# Altium project pca10171.PrjPCB (part 4 of 4)

## Sheet pca10171_power_supply.SchDoc: =BoardTitle + ' - Power Supply'
size A3; Organization: Nordic Semiconductor; DocumentNumber: 8; Revision: 1.0.1; SheetNumber: 8; SheetTotal: 10; Author: KOD1; CompanyName: Nordic Semiconductor; DrawnBy: KOD1; DocumentSize: A3; ProjectName: nRF91 DK
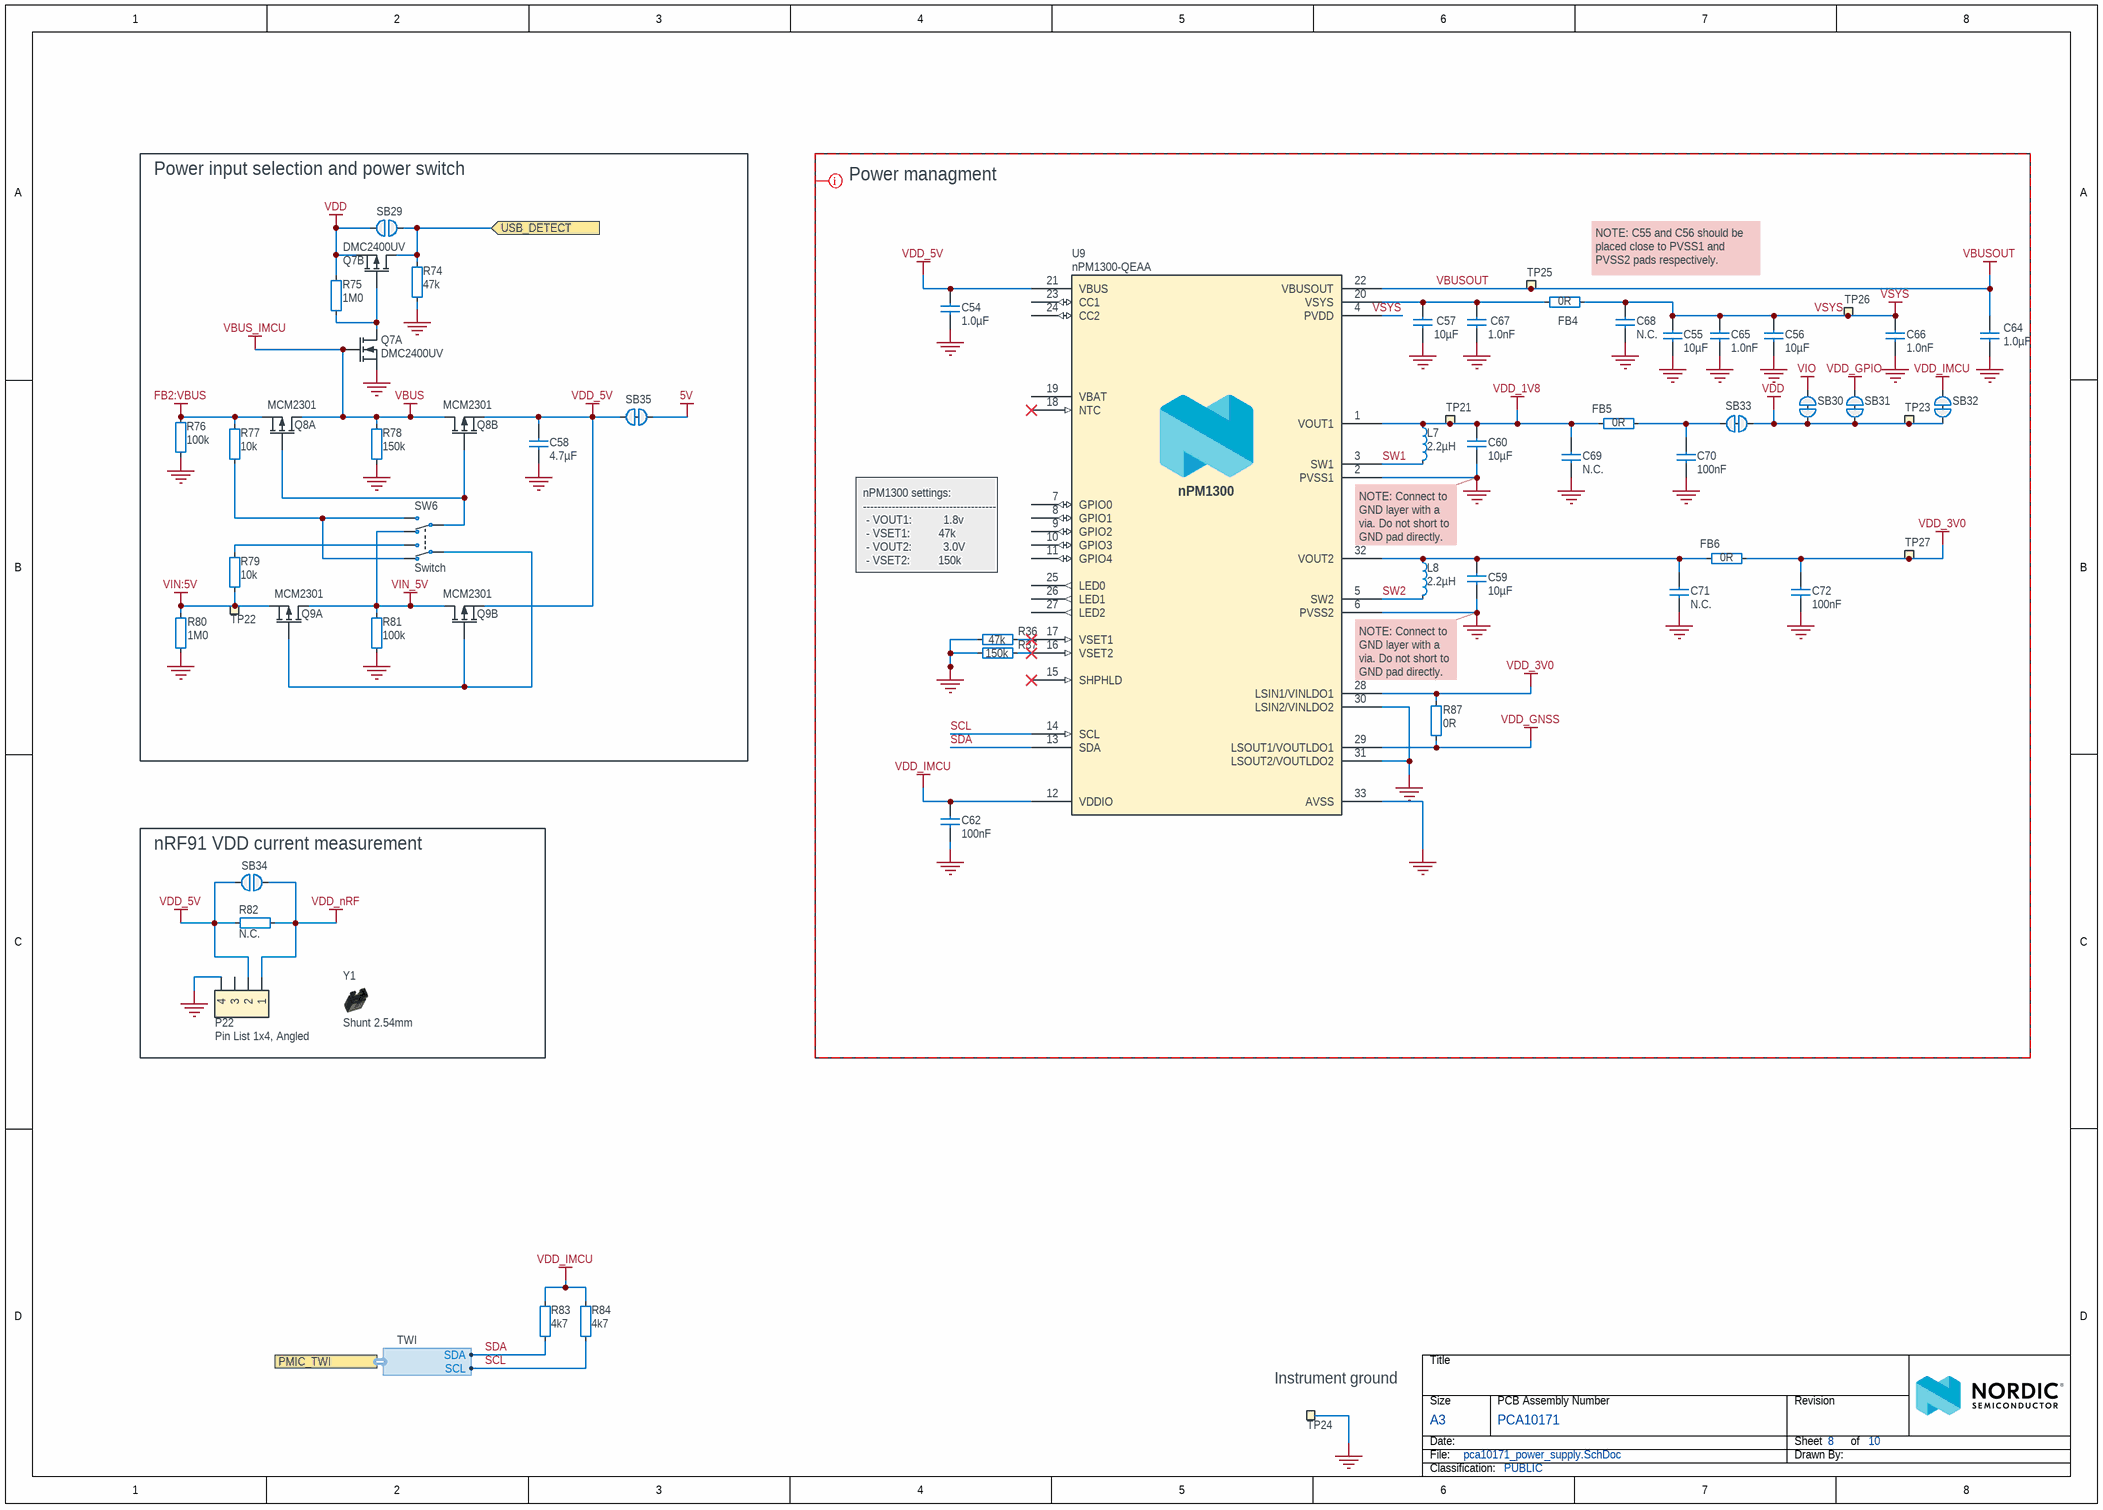
[diagram p9: pca10171_power_supply.SchDoc]

### Parts
C54  1.0µF  [CAPC1608X06L]
C55  10µF  [CAPC1608X06L]
C56  10µF  [CAPC1608X06L]
C57  10µF  [CAPC1608X06L]
C58  4.7µF  [CAPC1608X06L]
C59  10µF  [CAPC1608X06L]
C60  10µF  [CAPC1608X06L]
C62  100nF  [CAPC0603X03L_C]
C64  1.0µF  [CAPC1005X04L]
C65  1.0nF  [CAPC0603X03L_C]
C66  1.0nF  [CAPC0603X03L_C]
C67  1.0nF  [CAPC0603X03L_C]
C68  N.C.  [CAPC1608X06L_NC]
C69  N.C.  [CAPC1608X06L_NC]
C70  100nF  [CAPC1608X06L]
C71  N.C.  [CAPC1608X06L_NC]
C72  100nF  [CAPC1608X06L]
FB4  0R  [RESC2012X11L]
FB5  0R  [RESC2012X11L]
FB6  0R  [RESC2012X11L]
L7  2.2µH  [INDC2016X10N]
L8  2.2µH  [INDC2016X10N]
P22  Pin List 1x4, Angled  [LIST_ANG_1x4-SMD-2.54MM]
Q7  DMC2400UV  [SOTFL50P162X60-6N]  (parts A,B of 2)
Q8  MCM2301  [DFN65P200X200X80_HS-6N]  (parts A,B of 2)
Q9  MCM2301  [DFN65P200X200X80_HS-6N]  (parts A,B of 2)
R36  47k  [RESC0603X03L_C]
R37  150k  [RESC0603X03L_C]
R74  47k  [RESC0603X03L_C]
R75  1M0  [RESC0603X03L_C]
R76  100k  [RESC0603X03L_C]
R77  10k  [RESC0603X03L_C]
R78  150k  [RESC0603X03L_C]
R79  10k  [RESC0603X03L_C]
R80  1M0  [RESC0603X03L_C]
R81  100k  [RESC0603X03L_C]
R82  N.C.  [RESC1005X04L_NC]
R83  4k7  [RESC0603X03L_C]
R84  4k7  [RESC0603X03L_C]
R87  0R  [RESC0603X03L_C]
SB29  Solderbridge  [Solderbridge]  (value not drawn)  (no BOM)
SB30  Solderbridge  [Solderbridge_Shorted_Power]  (value not drawn)  (net tie, no BOM)
SB31  Solderbridge  [Solderbridge_Shorted_Power]  (value not drawn)  (net tie, no BOM)
SB32  Solderbridge  [Solderbridge_Shorted]  (value not drawn)  (net tie, no BOM)
SB33  Solderbridge  [Solderbridge_Shorted_Power]  (value not drawn)  (net tie, no BOM)
SB34  Solderbridge  [Solderbridge]  (value not drawn)  (no BOM)
SB35  Solderbridge  [Solderbridge_Shorted_Power]  (value not drawn)  (net tie, no BOM)
SW6  Switch  [JS102011JAQN]
TP21  Ø1.5mm,SMD  [TP_SMD_D1.5mm]  (value not drawn)  (no BOM)
TP22  Ø1.5mm,SMD  [TP_SMD_D1.5mm]  (value not drawn)  (no BOM)
TP23  Ø1.5mm,SMD  [TP_SMD_D1.5mm]  (value not drawn)  (no BOM)
TP24  TP  [TESTPAD-TH]  (value not drawn)  (no BOM)
TP25  Ø1.5mm,SMD  [TP_SMD_D1.5mm]  (value not drawn)  (no BOM)
TP26  Ø1.5mm,SMD  [TP_SMD_D1.5mm]  (value not drawn)  (no BOM)
TP27  Ø1.5mm,SMD  [TP_SMD_D1.5mm]  (value not drawn)  (no BOM)
U9  nPM1300-QEAA  [Nordic_QFN50P500X500X90-33N]
Y1  Shunt 2.54mm  [Shunt_2.54mm_Horizontal]

### Blocks framed on the sheet
Power input selection and power switch: C58 Q7-Q9 R74-R81 SB29 SB35 SW6 TP22
Power managment: C54-C57 C59 C60 C62 C64-C72 FB4-FB6 L7 L8 R36 R37 R87 SB30-SB33 TP21 TP23 TP25-TP27 U9
nRF91 VDD current measurement: P22 R82 SB34 Y1

### Ports
PMIC_TWI (harness TWI), USB_DETECT (in)

### Harnesses
TWI: SCL, SDA

### Nets
5V: SB35.2
FB2:VBUS: Q8.1(S1) R76.1 R77.1
GND: C54.1 C55.1 C56.1 C57.1 C58.1 C59.1 C60.1 C62.2 C64.1 C65.1 C66.1 C67.1 C68.1 C69.1 C70.1 C71.1 C72.1 P22.4 Q7.1(S1) R36.2 R37.2 R74.1 R76.2 R78.1 R80.2 R81.2 TP24.1 U9.2(PVSS1) U9.6(PVSS2) U9.30(LSIN2/VINLDO2) U9.31(LSOUT2/VOUTLDO2) U9.33(AVSS)
VBUS: Q7.2(G1) Q8.3(D2) Q8.6(D1) R78.2  [also labelled VBUS_IMCU]
VBUSOUT: C64.2 TP25.1 U9.22(VBUSOUT)
VDD: Q7.4(S2) R75.1 SB29.1 SB30.2 SB31.1 SB32.1 SB33.2 TP23.1
VDD_1V8: C60.2 C69.2 FB5.1 L7.1 TP21.1 U9.1(VOUT1)
VDD_3V0: C72.2 FB6.2 R87.1 TP27.1 U9.28(LSIN1/VINLDO1)
VDD_5V: C54.2 C58.2 P22.2 Q8.4(S2) Q9.4(S2) R82.2 SB34.2 SB35.1 U9.21(VBUS)
VDD_GNSS: R87.2 U9.29(LSOUT1/VOUTLDO1)
VDD_GPIO: SB31.2
VDD_IMCU: C62.1 R83.2 R84.2 SB32.2 U9.12(VDDIO)
VDD_nRF: P22.1 R82.1 SB34.1
VIN:5V: Q9.1(S1) R79.2 R80.1 TP22.1
VIN_5V: Q9.3(D2) Q9.6(D1) R81.1 SW6.6(N.C-2)
VIO: SB30.1
VSYS: C55.2 C56.2 C65.2 C66.2 C68.2 FB4.2 TP26.1 U9.4(PVDD)
SCL: R84.1 U9.14(SCL) ; port PMIC_TWI.SCL  [project net IMCU_SCL]
SDA: R83.1 U9.13(SDA) ; port PMIC_TWI.SDA  [project net IMCU_SDA]
SW1: L7.2 U9.3(SW1)
SW2: L8.2 U9.5(SW2)
USB_DETECT: Q7.3(D2) R74.2 SB29.2 ; port USB_DETECT
NetC57_2: C57.2 C67.2 FB4.1 U9.20(VSYS)
NetC59_2: C59.2 C71.2 FB6.1 L8.1 U9.32(VOUT2)
NetC70_2: C70.2 FB5.2 SB33.1
NetQ7_5: Q7.5(G2) Q7.6(D1) R75.2
NetQ8_2: Q8.2(G1) Q8.5(G2) SW6.5(COM-2)
NetQ9_2: Q9.2(G1) Q9.5(G2) SW6.2(COM-1)
NetR36_1: R36.1 U9.17(VSET1)
NetR37_1: R37.1 U9.16(VSET2)
NetR77_2: R77.2 SW6.3(N.C-1) SW6.4(N.O-2)
NetR79_1: R79.1 SW6.1(N.O-1)

Not connected (* = marked no-connect by the designer): P22 3; U9 7(GPIO0) 8(GPIO1) 9(GPIO2) 10(GPIO3) 11(GPIO4) 15(SHPHLD)* 18(NTC)* 19(VBAT) 23(CC1) 24(CC2) 25(LED0) 26(LED1) 27(LED2)

### Layout directives
CompClassName: nPM1300: GND, SCL, SDA, SW1, SW2, VBUSOUT, VDD, VDD_1V8, VDD_3V0, VDD_5V, VDD_GNSS, VDD_GPIO, VDD_IMCU, VIO, VSYS

### Notes on the sheet
- NOTE: C55 and C56 should be placed close to PVSS1 and PVSS2 pads respectively.
- nPM1300 settings:
  -------------------------------------
  - VOUT1:          1.8v
  - VSET1:	        47k
  - VOUT2:          3.0V
  - VSET2:	        150k
- NOTE: Connect to GND layer with a via. Do not short to GND pad directly.
- (near TP24) Instrument ground
- Title
- Size
- Date:
- File:
- A3
- PCB Assembly Number
- Sheet         of
- Drawn By:
- Revision
- Classification:
- (in symbol nPM1300-QEAA) nPM1300

### Library data of the parts
C54 = C0603-1µ0-10V-X5R: Capacitor, Ceramic, 1.0µF 10V X5R 0603,±10%; Manufacturer: N.A.; Part number NEMS: 100200528; Component Status: Active; Pad Count: 2; Part Number: C0603-1µ0-10V-X5R; PartId: 100200528; Component Class: Capacitors; Author: getr; Manufacturer Part Number: N.A.; ComponentLink1URL: N.A.; ComponentLink1Description: Datasheet; ComponentLink2URL: N.A.; ComponentLink2Description: Supplier link; HelpURL: N.A.; LatestRevisionDate: 2022-10-06; Published: 2022-10-06; Footprint Doc: 0603; Value: 1.0µF; Note: 10V; Supplier 1: N.A.; Supplier Part Number 1: N.A.; Supplier 2: N.A.; Supplier Part Number 2: N.A.; Artikkelnr Noca: N.A.; Part number IPS: N.A.; Part number Norautron: N.A.
C55-C57 C59 C60 = C0603-10µ-10V-X7T-GRM188D71A106MA73: Capacitor, X7T, ±20%, 10V; Manufacturer: Murata; Part number IPS: 00000004696; Part number NEMS: 100200414; Component Status: Active; Pad Count: 2; Note: 10VDC; Artikkelnr Noca: N.A.; Part Number: C0603-10µ-10V-X7T-GRM188D71A106MA73; PartId: 100200414; Component Class: Capacitors; Author: rsk; Manufacturer Part Number: GRM188D71A106MA73; ComponentLink1URL: N.A.; ComponentLink1Description: Datasheet; ComponentLink2URL: N.A.; ComponentLink2Description: Supplier link; HelpURL: https://no.mouser.com/datasheet/2/281/murata_03052018_GRM_Series_1-1310166.pdf; LatestRevisionDate: 2021-07-22; Published: 2018-09-11; Footprint Doc: 0603; Value: 10µF; Supplier 1: Digi-Key; Supplier Part Number 1: 490-7200-1-ND; Supplier 2: Mouser; Supplier Part Number 2: 81-GRM188D71A106MA3D; Part number Norautron: N.A.
C58 = C0603-4µ7-10V-X5R: Capacitor, Ceramic, X5R, ±10%, 10V; Manufacturer: N.A.; Part number Norautron: 262081761; Part number NEMS: 100200479; Pad Count: 2; Component Status: Active; Part Number: C0603-4µ7-10V-X5R; Manufacturer Part Number: N.A.; ComponentLink1URL: N.A.; ComponentLink1Description: Datasheet; ComponentLink2URL: N.A.; ComponentLink2Description: Supplier link; HelpURL: N.A.; Footprint Doc: 0603; LatestRevisionDate: 2021-07-22; Published: 2021-07-22; Value: 4.7µF; Note: 10V; Supplier 1: N.A.; Supplier Part Number 1: N.A.; Supplier 2: N.A.; Supplier Part Number 2: N.A.; Artikkelnr Noca: N.A.; Part number IPS: N.A.; Component Class: Capacitors; PartId: 100200479; Author: rubr
C62 = C0201-100n: Capacitor, X5R, ±10%; Manufacturer: N.A.; Part number IPS: 00000001248, 00000002505; Part number Norautron: 262071862; Part number NEMS: 100200078; Pad Count: 2; Note: 16V; Component Status: Active; Part Number: C0201-100n; Value: 100nF; Footprint Doc: 0201; Component Class: Capacitors; Author: rsk; PartId: 100200078; Manufacturer Part Number: N.A.; ComponentLink1URL: N.A.; ComponentLink1Description: Datasheet; ComponentLink2URL: N.A.; ComponentLink2Description: Supplier link; HelpURL: N.A.; LatestRevisionDate: 2017-11-09; Published: 2014-11-13; Supplier 1: N.A.; Supplier Part Number 1: N.A.; Supplier 2: N.A.; Supplier Part Number 2: N.A.; Artikkelnr Noca: N.A.
C64 = C0402-1µ0-10V-X5R: Capacitor, Ceramic, X5R, ±10%, 10V; Manufacturer: N.A.; Part number NEMS: 100200482; Pad Count: 2; Component Status: Active; Part Number: C0402-1µ0-10V-X5R; Manufacturer Part Number: N.A.; Footprint Doc: 0402; LatestRevisionDate: 2021-07-22; Published: 2021-07-22; Value: 1.0µF; Note: 10V; Artikkelnr Noca: N.A.; Part number IPS: N.A.; ComponentLink1URL: N.A.; ComponentLink1Description: Datasheet; ComponentLink2URL: N.A.; ComponentLink2Description: Supplier link; HelpURL: N.A.; Supplier 1: N.A.; Supplier Part Number 1: N.A.; Supplier 2: N.A.; Supplier Part Number 2: N.A.; Component Class: Capacitors; PartId: 100200482; Author: rubr; Part number Norautron: N.A.
C65-C67 = C0201-1n0: Capacitor, X7R, ±10%, 25V; Manufacturer: N.A.; Part number IPS: 00000003206; Part number NEMS: 100200056; Component Status: Active; Pad Count: 2; Note: 16V; Part Number: C0201-1n0; PartId: 100200056; Component Class: Capacitors; Author: rsk; Manufacturer Part Number: N.A.; ComponentLink1URL: N.A.; ComponentLink1Description: Datasheet; ComponentLink2URL: N.A.; ComponentLink2Description: Supplier link; HelpURL: N.A.; LatestRevisionDate: 2020-10-13; Published: 2014-11-13; Footprint Doc: 0201; Value: 1.0nF; Supplier 1: N.A.; Supplier Part Number 1: N.A.; Supplier 2: N.A.; Supplier Part Number 2: N.A.; Artikkelnr Noca: N.A.; Part number Norautron: N.A.
C68 C69 C71 = C0603-N.C.: Not mounted; Manufacturer: N.A.; Part number NEMS: 100200195; Component Status: Active; Pad Count: 2; Note: Chip Cap; Assembly: Not mounted; Part Number: C0603-N.C.; PartId: 100200195; Component Class: Capacitors; Author: rsk; Manufacturer Part Number: N.A.; ComponentLink1URL: N.A.; ComponentLink1Description: Datasheet; ComponentLink2URL: N.A.; ComponentLink2Description: Supplier link; HelpURL: N.A.; Footprint Doc: 0603; LatestRevisionDate: 2009-05-08; Published: 2009-05-08; Value: N.C.; Supplier 1: N.A.; Supplier Part Number 1: N.A.; Supplier 2: N.A.; Supplier Part Number 2: N.A.; Artikkelnr Noca: N.A.; Part number IPS: N.A.; Part number Norautron: N.A.
C70 C72 = C0603-100n: Chip Cap 0603; Manufacturer: N.A.; Part number NEMS: 100200265; Component Status: Active; Pad Count: 2; Note: Chip Cap 1%; Part Number: C0603-100n; PartId: 100200265; Component Class: Capacitors; Author: rsk; Manufacturer Part Number: N.A.; ComponentLink1URL: N.A.; ComponentLink1Description: Datasheet; ComponentLink2URL: N.A.; ComponentLink2Description: Supplier link; HelpURL: N.A.; Footprint Doc: 0603; LatestRevisionDate: 2009-05-08; Published: 2009-05-08; Value: 100nF; Supplier 1: N.A.; Supplier Part Number 1: N.A.; Supplier 2: N.A.; Supplier Part Number 2: N.A.; Artikkelnr Noca: N.A.; Part number IPS: N.A.; Part number Norautron: N.A.
FB4-FB6 = R0805-0R: Resistor, ±5%, 0.125W; Manufacturer: N.A.; Part number NEMS: 100100375; Component Status: Active; Pad Count: 2; Note: Chip Res 5%; Artikkelnr Noca: 27089000; Part Number: R0805-0R; PartId: 100100375; Component Class: Resistors; Author: rsk; Manufacturer Part Number: N.A.; ComponentLink1URL: N.A.; ComponentLink1Description: Datasheet; ComponentLink2URL: N.A.; ComponentLink2Description: Supplier link; HelpURL: N.A.; Footprint Doc: 0805; LatestRevisionDate: 2013-06-04; Published: 2009-05-08; Value: 0R; Supplier 1: N.A.; Supplier Part Number 1: N.A.; Supplier 2: N.A.; Supplier Part Number 2: N.A.; Part number IPS: N.A.; Part number Norautron: N.A.
L7 L8 = L0806-2µ2-2500mA-73mOhm-CIGT201610EH2R2MNE: Inductor, Irms=2.5A, Isat=2.9A, ±20%, DCR=73mΩ; Manufacturer: Samsung Electro-Mechanics America; Part number Norautron: 26521789; Part number NEMS: 100300400; Component Status: Active; Pad Count: 2; Note: Unshielded Thin Film Inductor; Artikkelnr Noca: N.A.; Part Number: L0806-2µ2-2500mA-73mOhm-CIGT201610EH2R2MNE; PartId: 100300400; Component Class: Inductors; Author: rsk; Manufacturer Part Number: CIGT201610EH2R2MNE; ComponentLink1URL: https://media.digikey.com/pdf/Data%20Sheets/Samsung%20PDFs/CIGT201610EH2R2MNE_Spec.pdf; ComponentLink1Description: Datasheet; ComponentLink2URL: https://www.digikey.com/en/products/detail/samsung-electro-mechanics/CIGT201610EH2R2MNE/7041223?s=N4IgTCBcDaIMIEkDiAVMAGAjANk%2BgogBJgBKYAsgHL4gC6AvkA; ComponentLink2Description: Supplier link; HelpURL: http://product.samsungsem.com/pi/CIGT201610EH2R2MN.do; LatestRevisionDate: 2022-09-07; Published: 2021-02-03; Footprint Doc: 0806; Value: 2.2µH; Supplier 1: Digi-Key; Supplier Part Number 1: 1276-6901-1-ND; Supplier 2: Mouser; Supplier Part Number 2: 187-CIGT201610EH2R2M; Part number IPS: N.A.
P22 = Pin List Ang 1x4 SMD, 2.54mm: Pin List 1x4, 2.54mm (100mil), Right Angled, SMD; Manufacturer: WCON; Manufacturer Part Number: 1125B-1104S0Z135CR02; Part number IPS: 00000004780; Part number NEMS: 100500358; Note: N.A.; Pad Count: 4; Component Status: Active; System: Connector; Part Number: Pin List Ang 1x4 SMD, 2.54mm; ComponentLink1URL: N.A.; ComponentLink1Description: Datasheet; ComponentLink2URL: N.A.; ComponentLink2Description: Supplier link; HelpURL: N.A.; Footprint Doc: LIST_ANG_1x4-SMD-2.54MM; LatestRevisionDate: 2020-04-29; Published: 2015-01-23; Value: Pin List 1x4, Angled; Supplier 1: Cabcon; Supplier Part Number 1: 1125B-1104S0Z135CR02; Supplier 2: Samtec; Supplier Part Number 2: TSM-104-01-L-SH-A; Artikkelnr Noca: N.A.; PartId: 100500358; Component Class: Connectors; Author: rsk; Part number Norautron: N.A.
Q7 = DMC2400UV: Dual N & P Ch MOFET, 1.03A/0.7A, 480mOhm, 450mW; Manufacturer: Diodes Incorporated; Part number IPS: 00000007803; Part number NEMS: 101300117; Note: Dual N & P Channel Digital FET; Artikkelnr Noca: N.A.; Pad Count: 6; Component Status: Active; Part Number: DMC2400UV; Manufacturer Part Number: DMC2400UV; LatestRevisionDate: 2016-01-18; Published: 2016-01-18; Value: DMC2400UV; Footprint Doc: SOT-563; ComponentLink1URL: N.A.; ComponentLink1Description: Datasheet; ComponentLink2URL: N.A.; ComponentLink2Description: Supplier link; HelpURL: http://www.diodes.com/_files/datasheets/DMC2400UV.pdf; Supplier 1: Digi-Key; Supplier Part Number 1: DMC2400UV-7DICT-ND; Supplier 2: N.A.; Supplier Part Number 2: N.A.; PartId: 101300117; Component Class: Semiconductors; Author: rsk; Part number Norautron: N.A.
Q8 Q9 = MCM2301: Dual P-Channel MOFET, 3.8A, 90mOhm max, 1.4W; Manufacturer: Micro Commercial Components; Part number NEMS: 101300199; Note: N.A.; Pad Count: 6; Component Status: Active; Part Number: MCM2301; Manufacturer Part Number: MCM2301; ComponentLink1URL: https://www.mccsemi.com/pdf/Products/MCM2301(DFN2020-6L).pdf; ComponentLink1Description: Datasheet; ComponentLink2URL: https://www.digikey.com/en/products/detail/micro-commercial-co/MCM2301-TP/9655971; ComponentLink2Description: Supplier link; HelpURL: https://www.mccsemi.com/product-detail/MCM2301; Footprint Doc: VDFN-6; LatestRevisionDate: 2022-12-27; Published: 2022-12-27; Value: MCM2301; Supplier 1: Digi-Key; Supplier Part Number 1: MCM2301-TPMSCT-ND; Supplier 2: Mouser; Supplier Part Number 2: 833-MCM2301-TP; Artikkelnr Noca: N.A.; Part number IPS: N.A.; Component Class: Semiconductors; Author: rubr; Part number Norautron: N.A.; PartId: 101300199
R36 = R0201-47k: Resistor, ±1%, 0.05W; Manufacturer: N.A.; Part number IPS: 00000001423; Part number NEMS: 100100076; Component Status: Active; Pad Count: 2; Note: Chip Res 1%; Part Number: R0201-47k; PartId: 100100076; Component Class: Resistors; Author: rsk; Manufacturer Part Number: N.A.; ComponentLink1URL: N.A.; ComponentLink1Description: Datasheet; ComponentLink2URL: N.A.; ComponentLink2Description: Supplier link; HelpURL: N.A.; LatestRevisionDate: 2014-11-13; Published: 2014-11-13; Footprint Doc: 0201; Value: 47k; Supplier 1: N.A.; Supplier Part Number 1: N.A.; Supplier 2: N.A.; Supplier Part Number 2: N.A.; Artikkelnr Noca: N.A.; Part number Norautron: N.A.
R37 = R0201-150k: Resistor, ±1%, 0.05W; Manufacturer: N.A.; Part number IPS: 00000001422; Part number NEMS: 100100082; Component Status: Active; Pad Count: 2; Note: Chip Res 1%; Part Number: R0201-150k; PartId: 100100082; Component Class: Resistors; Author: rsk; Manufacturer Part Number: N.A.; ComponentLink1URL: N.A.; ComponentLink1Description: Datasheet; ComponentLink2URL: N.A.; ComponentLink2Description: Supplier link; HelpURL: N.A.; LatestRevisionDate: 2014-11-13; Published: 2014-11-13; Footprint Doc: 0201; Value: 150k; Supplier 1: N.A.; Supplier Part Number 1: N.A.; Supplier 2: N.A.; Supplier Part Number 2: N.A.; Artikkelnr Noca: N.A.; Part number Norautron: N.A.
R74 = R0201-47k: Resistor, ±1%, 0.05W; Manufacturer: N.A.; Part number IPS: 00000001423; Part number NEMS: 100100076; Note: Chip Res 1%; Pad Count: 2; Component Status: Active; Part Number: R0201-47k; Manufacturer Part Number: N.A.; ComponentLink1URL: N.A.; ComponentLink1Description: Datasheet; ComponentLink2URL: N.A.; ComponentLink2Description: Supplier link; HelpURL: N.A.; Footprint Doc: 0201; LatestRevisionDate: 2014-11-13; Published: 2014-11-13; Value: 47k; Artikkelnr Noca: N.A.; Supplier 1: N.A.; Supplier Part Number 1: N.A.; Supplier 2: N.A.; Supplier Part Number 2: N.A.; PartId: 100100076; Component Class: Resistors; Author: rsk; Part number Norautron: N.A.
R75 R80 = R0201-1M0: Resistor, ±1%, 0.05W; Manufacturer: N.A.; Part number IPS: 00000001418; Part number Norautron: 26107108; Part number NEMS: 100100093; Note: Chip Res 1%; Pad Count: 2; Component Status: Active; Part Number: R0201-1M0; Manufacturer Part Number: N.A.; ComponentLink1URL: N.A.; ComponentLink1Description: Datasheet; ComponentLink2URL: N.A.; ComponentLink2Description: Supplier link; HelpURL: N.A.; Footprint Doc: 0201; LatestRevisionDate: 2014-11-13; Published: 2014-11-13; Value: 1M0; Artikkelnr Noca: N.A.; Supplier 1: N.A.; Supplier Part Number 1: N.A.; Supplier 2: N.A.; Supplier Part Number 2: N.A.; PartId: 100100093; Component Class: Resistors; Author: rsk
R76 R81 = R0201-100k: as R63-R65 on sheet pca10171_connectors; Part Number: R0201-100k; Manufacturer Part Number: N.A.; LatestRevisionDate: 2014-11-13; Published: 2014-11-13; Value: 100k; Artikkelnr Noca: N.A.; Footprint Doc: 0201; ComponentLink1URL: N.A.; ComponentLink1Description: Datasheet; ComponentLink2URL: N.A.; ComponentLink2Description: Supplier link; HelpURL: N.A.; Supplier 1: N.A.; Supplier Part Number 1: N.A.; Supplier 2: N.A.; Supplier Part Number 2: N.A.; Component Class: Resistors; PartId: 100100080; Author: rsk
R77 R79 = R0201-10k: Resistor, ±1%, 0.05W; Manufacturer: N.A.; Part number IPS: 00000001255; Part number Norautron: 26107101; Part number NEMS: 100100065; Note: Chip Res 1%; Pad Count: 2; Component Status: Active; Part Number: R0201-10k; Manufacturer Part Number: N.A.; ComponentLink1URL: N.A.; ComponentLink1Description: Datasheet; ComponentLink2URL: N.A.; ComponentLink2Description: Supplier link; HelpURL: N.A.; Footprint Doc: 0201; LatestRevisionDate: 2014-11-13; Published: 2014-11-13; Value: 10k; Supplier 1: N.A.; Supplier Part Number 1: N.A.; Supplier 2: N.A.; Supplier Part Number 2: N.A.; Artikkelnr Noca: N.A.; Component Class: Resistors; PartId: 100100065; Author: rsk
R78 = R0201-150k: Resistor, ±1%, 0.05W; Manufacturer: N.A.; Part number IPS: 00000001422; Part number NEMS: 100100082; Note: Chip Res 1%; Pad Count: 2; Component Status: Active; Part Number: R0201-150k; Manufacturer Part Number: N.A.; ComponentLink1URL: N.A.; ComponentLink1Description: Datasheet; ComponentLink2URL: N.A.; ComponentLink2Description: Supplier link; HelpURL: N.A.; Footprint Doc: 0201; LatestRevisionDate: 2014-11-13; Published: 2014-11-13; Value: 150k; Artikkelnr Noca: N.A.; Supplier 1: N.A.; Supplier Part Number 1: N.A.; Supplier 2: N.A.; Supplier Part Number 2: N.A.; PartId: 100100082; Component Class: Resistors; Author: rsk; Part number Norautron: N.A.
R82 = R0402-N.C.: Not mounted; Manufacturer: N.A.; Part number NEMS: 100100281; Note: Chip Res; Assembly: Not mounted; Pad Count: 2; Component Status: Active; Part Number: R0402-N.C.; Manufacturer Part Number: N.A.; LatestRevisionDate: 2009-05-08; Published: 2009-05-08; Value: N.C.; Artikkelnr Noca: N.A.; Footprint Doc: 0402; Part number IPS: N.A.; ComponentLink1URL: N.A.; ComponentLink1Description: Datasheet; ComponentLink2URL: N.A.; ComponentLink2Description: Supplier link; HelpURL: N.A.; Supplier 1: N.A.; Supplier Part Number 1: N.A.; Supplier 2: N.A.; Supplier Part Number 2: N.A.; PartId: 100100281; Component Class: Resistors; Author: rsk; Part number Norautron: N.A.
R83 R84 = R0201-4k7: Resistor, ±1%, 0.05W; Manufacturer: N.A.; Part number IPS: 00000001706; Part number NEMS: 100100061; Note: Chip Res 1%; Pad Count: 2; Component Status: Active; Part Number: R0201-4k7; Manufacturer Part Number: N.A.; Footprint Doc: 0201; LatestRevisionDate: 2014-11-13; Published: 2014-11-13; Value: 4k7; Artikkelnr Noca: N.A.; ComponentLink1URL: N.A.; ComponentLink1Description: Datasheet; ComponentLink2URL: N.A.; ComponentLink2Description: Supplier link; HelpURL: N.A.; Supplier 1: N.A.; Supplier Part Number 1: N.A.; Supplier 2: N.A.; Supplier Part Number 2: N.A.; PartId: 100100061; Component Class: Resistors; Author: rsk; Part number Norautron: N.A.
R87 = R0201-0R: Resistor, ±5%, 0.05W; Manufacturer: N.A.; Part number IPS: 00000003245; Part number NEMS: 100100001; Component Status: Active; Pad Count: 2; Note: Chip Res 5%; Part Number: R0201-0R; PartId: 100100001; Component Class: Resistors; Author: rsk; Manufacturer Part Number: N.A.; ComponentLink1URL: N.A.; ComponentLink1Description: Datasheet; ComponentLink2URL: N.A.; ComponentLink2Description: Supplier link; HelpURL: N.A.; LatestRevisionDate: 2017-11-09; Published: 2014-11-13; Footprint Doc: 0201; Value: 0R; Supplier 1: N.A.; Supplier Part Number 1: N.A.; Supplier 2: N.A.; Supplier Part Number 2: N.A.; Artikkelnr Noca: N.A.; Part number Norautron: N.A.
SB29 SB34 = Solderbridge: Manufacturer: N.A.; Part number NEMS: 100500458; Pad Count: 2; Component Status: Active; System: Connector; Part Number: Solderbridge; Manufacturer Part Number: N.A.; LatestRevisionDate: 2009-12-14; Published: 2009-12-14; Value: Solderbridge; Note: N.A.; Artikkelnr Noca: N.A.; Footprint Doc: Solderbridge; Part number IPS: N.A.; ComponentLink1URL: N.A.; ComponentLink1Description: Datasheet; ComponentLink2URL: N.A.; ComponentLink2Description: Supplier link; HelpURL: N.A.; Supplier 1: N.A.; Supplier Part Number 1: N.A.; Supplier 2: N.A.; Supplier Part Number 2: N.A.; PartId: 100500458; Component Class: Connectors; Author: rsk; Part number Norautron: N.A.
SB30 SB31 SB33 SB35 = Solderbridge Shorted Power: Shorted Solderbridge Power; Manufacturer: N.A.; Part number NEMS: 100500460; Pad Count: 2; Component Status: Active; System: Connector; Part Number: Solderbridge Shorted Power; Manufacturer Part Number: N.A.; LatestRevisionDate: 2012-08-07; Published: 2012-08-07; Value: Solderbridge; Note: N.A.; Artikkelnr Noca: N.A.; Footprint Doc: Solderbridge_Shorted_Power; Part number IPS: N.A.; ComponentLink1URL: N.A.; ComponentLink1Description: Datasheet; ComponentLink2URL: N.A.; ComponentLink2Description: Supplier link; HelpURL: N.A.; Supplier 1: N.A.; Supplier Part Number 1: N.A.; Supplier 2: N.A.; Supplier Part Number 2: N.A.; PartId: 100500460; Component Class: Connectors; Author: rsk; Part number Norautron: N.A.
SB32 = Solderbridge Shorted: Shorted Solderbridge; Manufacturer: N.A.; Part number NEMS: 100500459; Pad Count: 2; Component Status: Active; System: Connector; Part Number: Solderbridge Shorted; Manufacturer Part Number: N.A.; LatestRevisionDate: 2012-08-07; Published: 2012-08-07; Value: Solderbridge; Note: N.A.; Artikkelnr Noca: N.A.; Footprint Doc: Solderbridge_Shorted; Part number IPS: N.A.; ComponentLink1URL: N.A.; ComponentLink1Description: Datasheet; ComponentLink2URL: N.A.; ComponentLink2Description: Supplier link; HelpURL: N.A.; Supplier 1: N.A.; Supplier Part Number 1: N.A.; Supplier 2: N.A.; Supplier Part Number 2: N.A.; PartId: 100500459; Component Class: Connectors; Author: rsk; Part number Norautron: N.A.
SW6 = Switch-Slide-RA-J-Lead-DPDT-8.5x3.5mm_C&K: SMD slide Switch (ON-ON); Manufacturer: C&K; Manufacturer Part Number: JS202011JAQN; Part number IPS: 00000007811; Part number NEMS: 101500037; Note: N.A.; Pad Count: 6; Component Status: Active; Part Number: Switch-Slide-RA-J-Lead-DPDT-8.5x3.5mm_C&K; Footprint Doc: Switch-Slide-RA-J-Lead-DPDT-8.5x3.5mm; LatestRevisionDate: 2017-02-01; Published: 2016-09-15; Value: Switch; Artikkelnr Noca: N.A.; ComponentLink1URL: N.A.; ComponentLink1Description: Datasheet; ComponentLink2URL: N.A.; ComponentLink2Description: Supplier link; HelpURL: http://www.ck-components.com/media/1422/js.pdf; Supplier 1: Digi-Key; Supplier Part Number 1: CKN10722CT-ND; Supplier 2: Mouser; Supplier Part Number 2: 611-JS202011JAQN; PartId: 101500037; Component Class: Switches; Author: rsk; Part number Norautron: N.A.
TP21-TP23 TP25-TP27 = TP_SMD_Ø1.5MM: as TP16-TP20 on sheet pca10171_connectors; Part Number: TP_SMD_Ø1.5MM; ComponentLink1URL: N.A.; ComponentLink1Description: Datasheet; ComponentLink2URL: N.A.; ComponentLink2Description: Supplier link; HelpURL: N.A.; Footprint Doc: TP_SMD_Ø1.5mm; LatestRevisionDate: 2021-03-05; Published: 2016-06-02; Value: Ø1.5mm,SMD; Note: N.A.; Supplier 1: N.A.; Supplier Part Number 1: N.A.; Supplier 2: N.A.; Supplier Part Number 2: N.A.; Artikkelnr Noca: N.A.; Part number IPS: N.A.; Component Class: Connectors; PartId: 100500477; Author: rsk; Part number Norautron: N.A.
TP24 = Testpoint TH: Testpoint, through hole; Manufacturer: N.A.; Part number NEMS: 100500464; Pad Count: 1; Component Status: Active; Part Number: Testpoint TH; Manufacturer Part Number: N.A.; Footprint Doc: TESTPAD-TH; LatestRevisionDate: 2009-12-12; Published: 2009-12-12; Value: TP; Note: N.A.; Artikkelnr Noca: N.A.; Part number IPS: N.A.; ComponentLink1URL: N.A.; ComponentLink1Description: Datasheet; ComponentLink2URL: N.A.; ComponentLink2Description: Supplier link; HelpURL: N.A.; Supplier 1: N.A.; Supplier Part Number 1: N.A.; Supplier 2: N.A.; Supplier Part Number 2: N.A.; PartId: 100500464; Component Class: Connectors; Author: rsk; Part number Norautron: N.A.
U9 = nPM1300-QEAA: Li-Ion/Li-Polymer USB-C battery charger with high efficiency buck regulators, LDOs or load switches, LED drivers, TWI and VBUSOUT; Manufacturer: Nordic Semiconductor; Part number NEMS: 102000291; Component Status: Active; Pad Count: 33; Note: N.A.; Part Number: nPM1300-QEAA; PartId: 102000291; Component Class: Nordic_Devices; Author: eisk; Manufacturer Part Number: nPM1300-QEAA; ComponentLink1URL: N.A.; ComponentLink1Description: Datasheet; ComponentLink2URL: N.A.; ComponentLink2Description: Supplier link; HelpURL: N.A.; LatestRevisionDate: 2023-05-25; Published: 2022-02-17; Footprint Doc: QFN-32; Value: nPM1300-QEAA; Supplier 1: Nordic Semiconductor; Supplier Part Number 1: nPM1300-QEAA; Supplier 2: N.A.; Supplier Part Number 2: N.A.; Artikkelnr Noca: N.A.; Part number IPS: N.A.; Part number Norautron: N.A.
Y1 = SHUNT JUMPER 2.54mm BLACK GOLD Horizontal (obsolete): Shunt Jumper 2.54mm Black; Manufacturer: 3M; Manufacturer Part Number: 969102-0000-DA; Part number IPS: 00000001916; Part number Norautron: N.A.; Part number NEMS: 100500644; Assembly: Placed on "VDD" pins of P22; Note: SHUNT JUMPER .1" BLACK GOLD, h=6.00mm, w=5.00mm; Artikkelnr Noca: 56099001; Pad Count: 2; System: Connector; Part Number: SHUNT JUMPER 2.54mm BLACK GOLD Horizontal (Obsolete); ComponentLink1URL: N.A.; ComponentLink1Description: Datasheet; ComponentLink2URL: N.A.; ComponentLink2Description: Supplier link; HelpURL: http://www.digikey.com/product-detail/en/969102-0000-DA; Footprint Doc: SHUNT JUMPER 2.54mm; LatestRevisionDate: 2021-06-28; Published: 2019-09-04; Value: Shunt 2.54mm; Supplier 1: Digi-Key; Supplier Part Number 1: 3M9580-ND; Supplier 2: N.A.; Supplier Part Number 2: N.A.; PartId: 100500644; Component Class: Connectors; Author: rsk; Component Status: Obsolete

## Nets that join several sheets
5V: pca10171_connectors (5 pins), pca10171_power_supply (SB35.2)
FB2:VBUS: pca10171_interface_mcu (J4.5), pca10171_connectors (C51.2 FB2.2), pca10171_power_supply (Q8.1 R76.1 R77.1)
GND: pca10171_nrf9151 (63 pins), pca10171_interface_mcu (38 pins), /S1 (C52_S1.2 U7_S1.6), /S2 (C52_S2.2 U7_S2.6 U7_S2.7 U7_S2.15), /S3 (C52_S3.2 U7_S3.6), /S4 (C52_S4.2 U7_S4.6), pca10171_leds_and_buttons (14 pins), /S5 (C52_S5.2 U7_S5.6), /S6 (C52_S6.2 U7_S6.6), /S7 (C53_S7.2 U8_S7.6), pca10171_io_expander (7 pins), pca10171_memory (C42.1 R38.1 U4.4 U4.9), /S8 (C52_S8.2 U7_S8.6), pca10171_connectors (94 pins), /S9 (C53_S9.2 U8_S9.6), /S10 (C52_S10.2 U7_S10.6), /S11 (C52_S11.2 U7_S11.6), pca10171_power_supply (32 pins)
VBUS: pca10171_interface_mcu (R21.1), pca10171_power_supply (Q7.2 Q8.3 Q8.6 R78.2)
VDD: pca10171_nrf9151 (R8.1 SB1.1), pca10171_interface_mcu (R23.2), /S1 (C52_S1.1 U7_S1.14), /S2 (C52_S2.1 U7_S2.14), /S3 (C52_S3.1 U7_S3.14), /S4 (C52_S4.1 U7_S4.14), /S5 (C52_S5.1 U7_S5.14), /S6 (C52_S6.1 U7_S6.14), /S7 (C53_S7.1 U8_S7.14 U8_S7.16), pca10171_memory (C42.2 R35.2 U4.8), /S8 (C52_S8.1 U7_S8.14), pca10171_connectors (10 pins), /S9 (C53_S9.1 U8_S9.14), /S10 (C52_S10.1 U7_S10.14), /S11 (C52_S11.1 U7_S11.14), pca10171_power_supply (8 pins)
VDD_3V0: pca10171_interface_mcu (R33.2), pca10171_leds_and_buttons (R39.2 R40.2 R41.2 R42.2), pca10171_power_supply (5 pins)
VDD_5V: pca10171_connectors (P20.11 P26.11), pca10171_power_supply (9 pins)
VDD_GNSS: pca10171_nrf9151 (C11.2 L3.1), pca10171_power_supply (R87.2 U9.29)
VDD_GPIO: pca10171_nrf9151 (C4.1 C5.1 M1.65 SB2.1), pca10171_connectors (P20.1 P26.1), pca10171_power_supply (SB31.2)
VDD_IMCU: pca10171_interface_mcu (30 pins), pca10171_power_supply (5 pins)
VDD_nRF: pca10171_nrf9151 (C1.1 C2.1 C3.1 FB1.1), pca10171_connectors (P20.10 P26.10), pca10171_power_supply (P22.1 R82.1 SB34.1)
VIN:5V: pca10171_connectors (P20.9 P26.9), pca10171_power_supply (Q9.1 R79.2 R80.1 TP22.1)
VIO: pca10171_connectors (9 pins), pca10171_power_supply (SB30.1)
VIOEXT: /S7 (U8_S7.15), pca10171_io_expander (12 pins)
AREF: pca10171_connectors (P4.8 P10.8 P16.16), /S10 (U7_S10.8)
BTN1_EXT: /S6 (U7_S6.15), pca10171_io_expander (D1.1 R52.1 R53.2)
BTN2_EXT: /S6 (U7_S6.3), pca10171_io_expander (D2.1 R54.1 R55.2)
BTN3_EXT: /S6 (U7_S6.7), pca10171_io_expander (D3.1 R56.1 R57.2)
BTN4_EXT: /S6 (U7_S6.11), pca10171_io_expander (D4.1 R60.1 R61.2)
BUTTON1: pca10171_leds_and_buttons (SW1.2), /S6 (U7_S6.16)
BUTTON2: pca10171_leds_and_buttons (SW2.2), /S6 (U7_S6.4)
BUTTON3: pca10171_leds_and_buttons (SW3.2), /S6 (U7_S6.8)
BUTTON4: pca10171_leds_and_buttons (SW4.2), /S6 (U7_S6.12)
COEX0: pca10171_nrf9151 (M1.52 R6.1 R7.2), pca10171_connectors (P24.1 P27.1), /S11 (U7_S11.1)
COEX1: pca10171_nrf9151 (M1.53), pca10171_connectors (P24.2 P27.2), /S11 (U7_S11.5)
COEX2: pca10171_nrf9151 (M1.54 R3.2), pca10171_connectors (P24.3 P27.3), /S11 (U7_S11.9)
COEX_SELECT: pca10171_interface_mcu (TP11.1 U3.AK14), pca10171_connectors (R66.2), /S11 (U7_S11.2 U7_S11.10)
D_N: pca10171_interface_mcu (U3.B4), pca10171_connectors (U1.7)
D_P: pca10171_interface_mcu (U3.B2), pca10171_connectors (U1.6)
DBG_CMD: pca10171_nrf9151 (SB11.1), pca10171_connectors (J8.3 P25.8)
EXT_MEM_~{CS}: pca10171_memory (U4.1), /S8 (U7_S8.16)
EXT_MEM_CTRL: pca10171_interface_mcu (U3.B14), pca10171_memory (R38.2), /S8 (U7_S8.2 U7_S8.10)
EXT_MEM_MISO: pca10171_memory (U4.2), /S8 (U7_S8.12)
EXT_MEM_MOSI: pca10171_memory (U4.5), /S8 (U7_S8.4)
EXT_MEM_SCK: pca10171_memory (U4.6), /S8 (U7_S8.8)
IMCU_SCL: pca10171_interface_mcu (U3.AF2), pca10171_power_supply (R84.1 U9.14)
IMCU_SDA: pca10171_interface_mcu (U3.AE1), pca10171_power_supply (R83.1 U9.13)
IN 3-4: pca10171_interface_mcu (R32.2), /S4 (U7_S4.10)
INT_EXT: /S7 (U8_S7.11), pca10171_io_expander (R50.1 U5.11)
IOEXP_CTRL: pca10171_interface_mcu (U3.A17), pca10171_leds_and_buttons (R47.2), /S5 (U7_S5.2 U7_S5.10), /S6 (U7_S6.2 U7_S6.10), /S7 (U8_S7.2)
LED1: pca10171_leds_and_buttons (Q4.2 R43.2), /S5 (U7_S5.16)
LED1_EXT: /S5 (U7_S5.15), pca10171_io_expander (U5.7)
LED2: pca10171_leds_and_buttons (Q4.5 R44.2), /S5 (U7_S5.4)
LED2_EXT: /S5 (U7_S5.3), pca10171_io_expander (U5.8)
LED3: pca10171_leds_and_buttons (Q5.2 R45.2), /S5 (U7_S5.8)
LED3_EXT: /S5 (U7_S5.7), pca10171_io_expander (U5.9)
LED4: pca10171_leds_and_buttons (Q5.5 R46.2), /S5 (U7_S5.12)
LED4_EXT: /S5 (U7_S5.11), pca10171_io_expander (U5.10)
MAGPIO0: pca10171_nrf9151 (M1.21), pca10171_connectors (P24.9 P27.9)
MAGPIO1: pca10171_nrf9151 (M1.22), pca10171_connectors (P24.10 P27.10)
MAGPIO2: pca10171_nrf9151 (M1.23), pca10171_connectors (P24.11 P27.11)
MIPI_SCLK: pca10171_nrf9151 (M1.28), pca10171_connectors (P24.6 P27.6)
MIPI_SDATA: pca10171_nrf9151 (M1.27), pca10171_connectors (P24.5 P27.5)
MIPI_VIO: pca10171_nrf9151 (M1.29), pca10171_connectors (P24.7 P27.7)
NetC48_1: pca10171_connectors (C48.1 D5.5 J5.C1), /S9 (U8_S9.15)
NetC49_2: pca10171_connectors (C49.2 U6.8), /S9 (U8_S9.1)
NetD5_6: pca10171_connectors (D5.6), /S9 (U8_S9.7)
NetD5_7: pca10171_connectors (D5.7), /S9 (U8_S9.3)
NetD5_8: pca10171_connectors (D5.8), /S9 (U8_S9.11)
NetP3_3: pca10171_connectors (P3.3 P9.3), /S11 (U7_S11.16)
NetP3_4: pca10171_connectors (P3.4 P9.4), /S11 (U7_S11.4)
NetP3_7: pca10171_connectors (P3.7 P9.7), /S11 (U7_S11.8)
NetP19_2: pca10171_interface_mcu (R28.2), pca10171_connectors (P19.2)
NetP19_4: pca10171_interface_mcu (R29.2), pca10171_connectors (P19.4)
NetP19_10: pca10171_interface_mcu (R30.2), pca10171_connectors (P19.10)
NetP20_4: pca10171_interface_mcu (R25.2), pca10171_connectors (P20.4 P26.4)
NetP20_5: pca10171_interface_mcu (R26.2), pca10171_connectors (P20.5 P26.5)
NetP20_7: pca10171_interface_mcu (R27.2), pca10171_connectors (P20.7 P26.7)
NetP28_2: pca10171_connectors (P28.2 P30.1 SB12.2), /S9 (U8_S9.16)
NetP29_2: pca10171_nrf9151 (SB5.2), /S2 (U7_S2.9), pca10171_connectors (P29.2)
NetP29_4: pca10171_nrf9151 (SB3.2), /S1 (U7_S1.1), pca10171_connectors (P29.4)
NetP29_5: pca10171_nrf9151 (SB4.2), /S1 (U7_S1.5), pca10171_connectors (P29.5)
NetP29_6: pca10171_nrf9151 (SB6.2), /S2 (U7_S2.13), pca10171_connectors (P29.6)
NetR11_2: pca10171_interface_mcu (R11.2 TP3.1), /S1 (U7_S1.16)
NetR12_2: pca10171_interface_mcu (R12.2 TP7.1), /S1 (U7_S1.8)
NetR15_2: pca10171_interface_mcu (R15.2 TP6.1), /S2 (U7_S2.12)
NetR16_2: pca10171_interface_mcu (R16.2 TP10.1), /S2 (U7_S2.4)
NetR19_2: pca10171_interface_mcu (R19.2), /S3 (U7_S3.13)
NetR20_2: pca10171_interface_mcu (R20.2), /S3 (U7_S3.9)
NetR22_2: pca10171_interface_mcu (R22.2), /S3 (U7_S3.1)
NetR35_1: pca10171_memory (R35.1), /S8 (U7_S8.15)
NetSB7_2: pca10171_nrf9151 (SB7.2), /S1 (U7_S1.9)
NetSB8_2: pca10171_nrf9151 (SB8.2), /S1 (U7_S1.13)
NetSB9_2: pca10171_nrf9151 (SB9.2), /S2 (U7_S2.1)
NetSB10_2: pca10171_nrf9151 (SB10.2), /S2 (U7_S2.5)
NetSB13_2: pca10171_connectors (SB13.2 SB14.2), /S9 (U8_S9.9)
NetSB21_1: pca10171_connectors (SB21.1), /S10 (U7_S10.5)
NetSB22_2: pca10171_connectors (SB22.2), /S10 (U7_S10.15)
NetSB23_2: pca10171_connectors (SB23.2), /S10 (U7_S10.3)
NetSB24_1: pca10171_connectors (SB24.1), /S10 (U7_S10.7)
NetU6_6: pca10171_connectors (U6.6), /S9 (U8_S9.5)
NetU6_7: pca10171_connectors (U6.7), /S9 (U8_S9.13)
P0.00: pca10171_nrf9151 (M1.56), /S5 (U7_S5.1), pca10171_connectors (P3.1 P9.1 P15.2)
P0.01: pca10171_nrf9151 (M1.57), /S5 (U7_S5.5), pca10171_connectors (P3.2 P9.2 P15.4)
P0.02: pca10171_nrf9151 (M1.58), pca10171_connectors (P15.6), /S11 (U7_S11.15)
P0.03: pca10171_nrf9151 (M1.59), pca10171_connectors (P15.8), /S11 (U7_S11.3)
P0.04: pca10171_nrf9151 (M1.61), /S5 (U7_S5.9), pca10171_connectors (P3.5 P9.5 P15.10)
P0.05: pca10171_nrf9151 (M1.62), /S5 (U7_S5.13), pca10171_connectors (P3.6 P9.6 P15.12)
P0.06: pca10171_nrf9151 (M1.63), pca10171_connectors (P15.14), /S11 (U7_S11.7)
P0.07: pca10171_nrf9151 (M1.64), pca10171_connectors (P3.8 P9.8 P15.16)
P0.08: pca10171_nrf9151 (M1.67), /S6 (U7_S6.1), pca10171_connectors (P4.1 P10.1 P16.2)
P0.09: pca10171_nrf9151 (M1.68), /S6 (U7_S6.5), pca10171_connectors (P4.2 P10.2 P16.4)
P0.10: pca10171_nrf9151 (M1.69), pca10171_connectors (P4.3 P10.3 P16.6)
P0.11: pca10171_nrf9151 (M1.70), /S8 (U7_S8.5), pca10171_connectors (5 pins)
P0.12: pca10171_nrf9151 (M1.72), /S8 (U7_S8.13), pca10171_connectors (5 pins)
P0.13/AIN0: pca10171_nrf9151 (M1.73), /S8 (U7_S8.9), pca10171_connectors (5 pins)
P0.14/AIN1: pca10171_nrf9151 (M1.74 SB5.1), pca10171_connectors (P2.1 P8.1 P14.2)
P0.15/AIN2: pca10171_nrf9151 (M1.75 SB6.1), pca10171_connectors (P2.2 P8.2 P14.4)
P0.16/AIN3: pca10171_nrf9151 (M1.77 SB9.1), pca10171_connectors (P2.3 P8.3 P14.6)
P0.17/AIN4: pca10171_nrf9151 (M1.78 SB10.1), pca10171_connectors (P2.4 P8.4 P14.8)
P0.18/AIN5: pca10171_nrf9151 (M1.79), /S6 (U7_S6.9), pca10171_connectors (P2.5 P8.5 P14.10)
P0.19/AIN6: pca10171_nrf9151 (M1.80), /S6 (U7_S6.13), /S7 (U8_S7.12), pca10171_connectors (P2.6 P8.6 P14.12)
P0.20/AIN7: pca10171_nrf9151 (M1.2), /S8 (U7_S8.1), /S10 (U7_S10.9)
P0.21: pca10171_nrf9151 (M1.5), pca10171_connectors (7 pins)
P0.22: pca10171_nrf9151 (M1.6), /S3 (U7_S3.4), pca10171_connectors (7 pins)
P0.23: pca10171_nrf9151 (M1.8), pca10171_connectors (5 pins)
P0.24: pca10171_nrf9151 (M1.11), pca10171_connectors (5 pins)
P0.25: pca10171_nrf9151 (M1.12), pca10171_connectors (5 pins)
P0.26: pca10171_nrf9151 (M1.44 SB3.1), pca10171_connectors (P6.6 P12.6 P17.12)
P0.27: pca10171_nrf9151 (M1.45 SB4.1), pca10171_connectors (P6.7 P12.7 P17.14)
P0.28: pca10171_nrf9151 (M1.47 SB7.1), pca10171_connectors (P6.8 P12.8 P17.16)
P0.29: pca10171_nrf9151 (M1.48 SB8.1), pca10171_connectors (P24.4 P27.4)
P0.30: pca10171_nrf9151 (M1.49), /S4 (U7_S4.15), /S7 (U8_S7.4), pca10171_connectors (P4.9 P10.9 P16.18)
P0.31: pca10171_nrf9151 (M1.50), /S4 (U7_S4.3), /S7 (U8_S7.8), pca10171_connectors (P4.10 P10.10 P16.20)
RESET: pca10171_nrf9151 (Q1.2 Q1.5 R9.1 R10.1), /S3 (U7_S3.16), pca10171_connectors (P18.10 P25.10)
RESET_BOTTOM: pca10171_connectors (P7.3 SB25.1 SB27.1), /S10 (U7_S10.1 U7_S10.4)
RESET_BUTTON: pca10171_interface_mcu (R23.1 U3.AL27), /S3 (U7_S3.15), pca10171_leds_and_buttons (SW5.2), pca10171_connectors (SB21.2 SB24.2)
RESET_IN_CTRL: pca10171_interface_mcu (U3.AD2), pca10171_connectors (R73.2), /S10 (U7_S10.10)
RESET_OUT_CTRL: pca10171_interface_mcu (U3.AH2), pca10171_connectors (R72.1), /S10 (U7_S10.2)
RESET_TOP: pca10171_connectors (P1.3 P13.6 SB27.2 SB28.1), /S10 (U7_S10.16)
SCL_EXT: /S7 (U8_S7.7), pca10171_io_expander (R49.1 U5.12)
SDA_EXT: /S7 (U8_S7.3), pca10171_io_expander (R48.1 U5.13)
SHIELD_DETECT: pca10171_interface_mcu (U3.AE31), pca10171_connectors (R69.1 SB18.2)
SIM_1V8: pca10171_nrf9151 (M1.19), pca10171_connectors (P30.2 SB12.1)
SIM_CLK: pca10171_nrf9151 (M1.18), pca10171_connectors (P28.5), /S9 (U8_S9.4)
SIM_IO: pca10171_nrf9151 (M1.17), pca10171_connectors (P28.4), /S9 (U8_S9.8)
SIM_RST: pca10171_nrf9151 (M1.16), pca10171_connectors (P28.6), /S9 (U8_S9.12)
SIM_SELECT: pca10171_interface_mcu (U3.AK8), pca10171_connectors (R63.1), /S9 (U8_S9.2)
SWD0_SEL: pca10171_interface_mcu (U3.B24), pca10171_connectors (P19.3)
SWD0_SWO: pca10171_interface_mcu (U3.B20), pca10171_connectors (P19.6)
SWD1_SEL: pca10171_interface_mcu (U3.AK22), pca10171_connectors (P20.8 P26.8 SB17.2)
SWD1_SWO: pca10171_interface_mcu (U3.AK26), pca10171_connectors (P20.6 P26.6)
SWD3_SWO: pca10171_interface_mcu (U3.W1), /S3 (U7_S3.5)
SWD_CTRL: pca10171_interface_mcu (R24.2 U3.AB2), /S3 (U7_S3.2 U7_S3.10)
SWDCLK: pca10171_nrf9151 (M1.3), /S3 (U7_S3.8), pca10171_connectors (P18.4 P25.4)
SWDIO: pca10171_nrf9151 (M1.4), /S3 (U7_S3.12), pca10171_connectors (P18.2 P25.2)
TGT_SCL: pca10171_interface_mcu (U3.AK12), /S4 (U7_S4.4)
TGT_SDA: pca10171_interface_mcu (U3.AK10), /S4 (U7_S4.16)
TGT_TWI_CTRL: pca10171_interface_mcu (R31.1 U3.AJ1), /S4 (U7_S4.2)
USB_DETECT: pca10171_interface_mcu (U3.Y2), pca10171_power_supply (Q7.3 R74.2 SB29.2)
VCOM0_CTRL: pca10171_interface_mcu (R13.1 U3.R31), /S1 (U7_S1.2)
VCOM0_CTS: pca10171_interface_mcu (R86.1 TP5.1 U3.AL9), /S2 (U7_S2.8)
VCOM0_HWFC: pca10171_interface_mcu (R17.1 U3.AK16), /S2 (U7_S2.2)
VCOM0_RXD: pca10171_interface_mcu (TP4.1 U3.AL19), /S1 (U7_S1.4)
VCOM1_CTRL: pca10171_interface_mcu (R14.2 U3.AK18), /S1 (U7_S1.10)
VCOM1_CTS: pca10171_interface_mcu (R85.1 TP9.1 U3.AL15), /S2 (U7_S2.16)
VCOM1_HWFC: pca10171_interface_mcu (R18.2 U3.AK20), /S2 (U7_S2.10)
VCOM1_RXD: pca10171_interface_mcu (TP8.1 U3.AL21), /S1 (U7_S1.12)
VIO_REF_SENSE: pca10171_interface_mcu (U3.V2), pca10171_connectors (R64.2 R65.2)

## Assembly variants
Full assembly: all parts fitted
Release: not fitted C16 C18 C19 C21 C22 C23 C49 C68 C69 C71 J8 L4 L5 P7 P8 P9 P10 P11 P12 P13 P14 P15 P16 P17 P26 P27 P29 R9 R23 R59 R82 U6